# EAGLE design dongle (EAGLE 9.6.2)
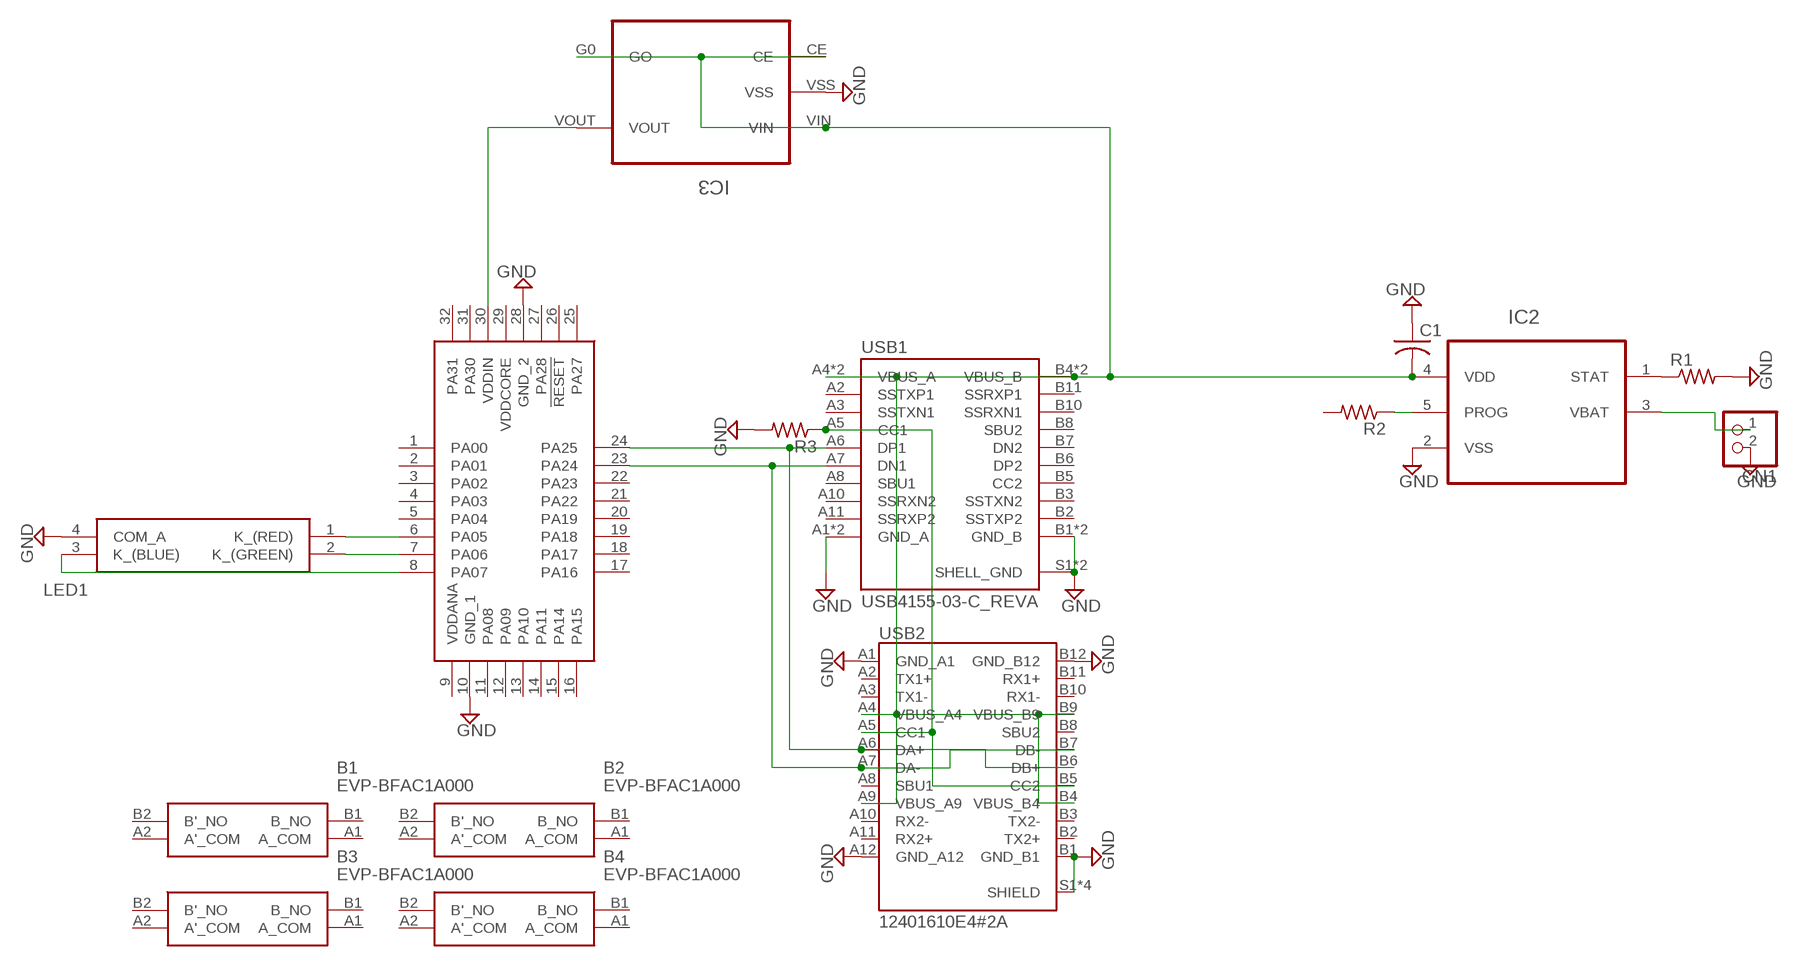
[diagram p0: schematic, sheet 1]

## Parts
B1  EVP-BFAC1A000  [EVPBFAC1A000]
B2  EVP-BFAC1A000  [EVPBFAC1A000]
B3  EVP-BFAC1A000  [EVPBFAC1A000]
B4  EVP-BFAC1A000  [EVPBFAC1A000]
C1  C-USC0805  [C0805]
CN1  JST_2PIN-SMT-RA  [JST-PH-2-SMT-RA]
IC1  ATSAMD21E18A-AFT  [QFP80P900X900X120-32N]
IC2  MCP73831T-2ACI/OT  [SOT95P280X145-5N]
IC3  IC_XC8107AC20MR-G  [IC_XC8107AC20MR-G]
LED1  ASMB-MTB1-0B3A2  [ASMBMTB10B3A2]
R1  R-US_R0805  [R0805]
R2  R-US_R0805  [R0805]
R3  R-US_R0805  [R0805]
USB1  USB4155-03-C_REVA  [GCT_USB4155-03-C_REVA]
USB2  12401610E4#2A  [AMPHENOL_12401610E4#2A]

## Nets
3.3V: IC1.30(VDDIN) IC3.VOUT
3.3VBAT: CN1.1 IC2.3(VBAT)
5VIN: C1.2 IC2.4(VDD) IC3.CE IC3.G0(GO) IC3.VIN USB1.A4(VBUS_A) USB1.A9(VBUS_A) USB1.B4(VBUS_B) USB1.B9(VBUS_B) USB2.A4(VBUS_A4) USB2.A9(VBUS_A9) USB2.B4(VBUS_B4) USB2.B9(VBUS_B9)
B: IC1.8(PA07) LED1.3(K_(BLUE))
CC: R3.1 USB1.A5(CC1) USB2.A5(CC1) USB2.B5(CC2)
D+: IC1.24(PA25) USB1.A6(DP1) USB2.A6(DA+) USB2.B6(DB+)
D-: IC1.23(PA24) USB1.A7(DN1) USB2.A7(DA-) USB2.B7(DB-)
G: IC1.7(PA06) LED1.2(K_(GREEN))
GND: C1.1 CN1.2 IC1.10(GND_1) IC1.28(GND_2) IC2.2(VSS) IC3.VSS LED1.4(COM_A) R1.2 R3.2 USB1.A1(GND_A) USB1.A12(GND_A) USB1.B1(GND_B) USB1.B12(GND_B) USB1.S1(SHELL_GND) USB1.S2(SHELL_GND) USB2.A1(GND_A1) USB2.A12(GND_A12) USB2.B1(GND_B1) USB2.B12(GND_B12) USB2.S1(SHIELD) USB2.S2(SHIELD) USB2.S3(SHIELD) USB2.S4(SHIELD)
PROG: IC2.5(PROG) R2.1
R: IC1.6(PA05) LED1.1(K_(RED))
STAT: IC2.1(STAT) R1.1
Unconnected: B1.A1(A_COM) B1.A2(A'_COM) B1.B1(B_NO) B1.B2(B'_NO) B2.A1(A_COM) B2.A2(A'_COM) B2.B1(B_NO) B2.B2(B'_NO) B3.A1(A_COM) B3.A2(A'_COM) B3.B1(B_NO) B3.B2(B'_NO) B4.A1(A_COM) B4.A2(A'_COM) B4.B1(B_NO) B4.B2(B'_NO) IC1.1(PA00) IC1.2(PA01) IC1.3(PA02) IC1.4(PA03) IC1.5(PA04) IC1.9(VDDANA) IC1.11(PA08) IC1.12(PA09) IC1.13(PA10) IC1.14(PA11) IC1.15(PA14) IC1.16(PA15) IC1.17(PA16) IC1.18(PA17) IC1.19(PA18) IC1.20(PA19) IC1.21(PA22) IC1.22(PA23) IC1.25(PA27) IC1.26(!RESET) IC1.27(PA28) IC1.29(VDDCORE) IC1.31(PA30) IC1.32(PA31) R2.2 USB1.A2(SSTXP1) USB1.A3(SSTXN1) USB1.A8(SBU1) USB1.A10(SSRXN2) USB1.A11(SSRXP2) USB1.B2(SSTXP2) USB1.B3(SSTXN2) USB1.B5(CC2) USB1.B6(DP2) USB1.B7(DN2) USB1.B8(SBU2) USB1.B10(SSRXN1) USB1.B11(SSRXP1) USB2.A2(TX1+) USB2.A3(TX1-) USB2.A8(SBU1) USB2.A10(RX2-) USB2.A11(RX2+) USB2.B2(TX2+) USB2.B3(TX2-) USB2.B8(SBU2) USB2.B10(RX1-) USB2.B11(RX1+)

## Library data of the parts
B1-B4 = EVP-BFAC1A000:EVP-BFAC1A000: Tactile Switches 6.0x6.0x3.4mm 2N w/4 Term .25mm Trvl IP67 Source: Datasheet <https://industrial.panasonic.com/cdbs/www-data/pdf/ATK0000/ATK0000C432.pdf>; DESCRIPTION: Tactile Switches 6.0x6.0x3.4mm 2N w/4 Term .25mm Trvl IP67; HEIGHT: 3.7mm; MANUFACTURER_NAME: Panasonic; MANUFACTURER_PART_NUMBER: EVP-BFAC1A000; MOUSER_PART_NUMBER: 667-EVP-BFAC1A000; MOUSER_PRICE-STOCK: https://www.mouser.co.uk/ProductDetail/Panasonic/EVP-BFAC1A000?qs=OiaALIbqWFSeImjptaxnOQ%3D%3D
C1 = adafruit:C-US: CAPACITOR, American symbol
CN1 = adafruit:JST_2PIN: JST 2-Pin Connectors of various flavors SMT-RA (S2B-PH-SM4) 4UConnector #17311 SMT (B2B-PH-SM4) THM-RA (S2B-PH) THM (B2B-PH)
IC1 = ATSAMD21E18A-AFT:ATSAMD21E18A-AFT: ARM Microcontrollers - MCU Cortex-M0+,64KB FLASH,8KB SRAM T&R, - 32TQFP 125C, GREEN,1.6-3.6V,48MHz Source: Datasheet <http://www.microchip.com/mymicrochip/filehandler.aspx?ddocname=en590209>; DESCRIPTION: ARM Microcontrollers - MCU Cortex-M0+,64KB FLASH,8KB SRAM T&R, - 32TQFP 125C, GREEN,1.6-3.6V,48MHz; HEIGHT: 1.2mm; MANUFACTURER_NAME: Microchip; MANUFACTURER_PART_NUMBER: ATSAMD21E18A-AFT; MOUSER_PART_NUMBER: 556-ATSAMD21E18A-AFT; MOUSER_PRICE-STOCK: https://www.mouser.co.uk/ProductDetail/Microchip-Technology-Atmel/ATSAMD21E18A-AFT?qs=9KdFJXLqUo%2Fx43XnpJTAog%3D%3D
IC2 = MCP73831T-2ACI_OT:MCP73831T-2ACI/OT: Charge Management Controller Check prices <https://pricing.snapeda.com/parts/MCP73831T-2ACI/OT/Microchip/view-part?ref=eda>; AVAILABILITY: In Stock; DESCRIPTION: Charger IC Lithium Ion/Polymer SOT-23-5; MF: Microchip; MP: MCP73831T-2ACI/OT; PACKAGE: SOT-23 Microchip; PRICE: None; PURCHASE-URL: https://pricing.snapeda.com/search/part/MCP73831T-2ACI/OT/?ref=eda
IC3 = IC_XC8107AC20MR-G:IC_XC8107AC20MR-G
LED1 = SamacSys_Parts:ASMB-MTB1-0B3A2: Standard LEDs - SMD PLCC4,T/Mt,BS/WF Silicone RGB Source: Datasheet <https://docs.broadcom.com/doc/AV02-4194EN>; DESCRIPTION: Standard LEDs - SMD PLCC4,T/Mt,BS/WF Silicone RGB; HEIGHT: 2.1mm; MANUFACTURER_NAME: Avago Technologies; MANUFACTURER_PART_NUMBER: ASMB-MTB1-0B3A2; MOUSER_PART_NUMBER: 630-ASMB-MTB1-0B3A2; MOUSER_PRICE-STOCK: https://www.mouser.co.uk/ProductDetail/Broadcom-Avago/ASMB-MTB1-0B3A2?qs=pUKx8fyJudDzsc2Rt%2Fv8dg%3D%3D
R1-R3 = rcl:R-US_: RESISTOR, American symbol; SPICEPREFIX: R
USB1 = USB4155-03-C_REVA:USB4155-03-C_REVA: Check prices <https://pricing.snapeda.com/parts/USB4155-03-C/Global%20Connector%20Technology/view-part?ref=eda>; AVAILABILITY: In Stock; DESCRIPTION: USB-C (USB TYPE-C) USB 3.2 Gen 2 (USB 3.1 Gen 2, Superspeed + (USB 3.1)) Plug Connector 24 Position Board Edge, Cutout; Surface Mount; Through Hole, Right Angle; MF: Global Connector Technology; MP: USB4155-03-C; PACKAGE: None; PRICE: None; PURCHASE-URL: https://pricing.snapeda.com/search/part/USB4155-03-C/?ref=eda
USB2 = 12401610E4_2A:12401610E4#2A: Usb Type-c, Ra Rcpt, Pcb Mount, Check prices <https://pricing.snapeda.com/parts/12401610E4%232A/Amphenol%20ICC%20%28Commercial%20Products%29/view-part?ref=eda>; AVAILABILITY: In Stock; DESCRIPTION: USB3.2 GEN2, Type C, Top mount, CH 1.58mm, Dual Row SMT; MF: Amphenol ICC (Commercial Products); MP: 12401610E4#2A; PACKAGE: None; PRICE: None; PURCHASE-URL: https://pricing.snapeda.com/search/part/12401610E4#2A/?ref=eda

## Board
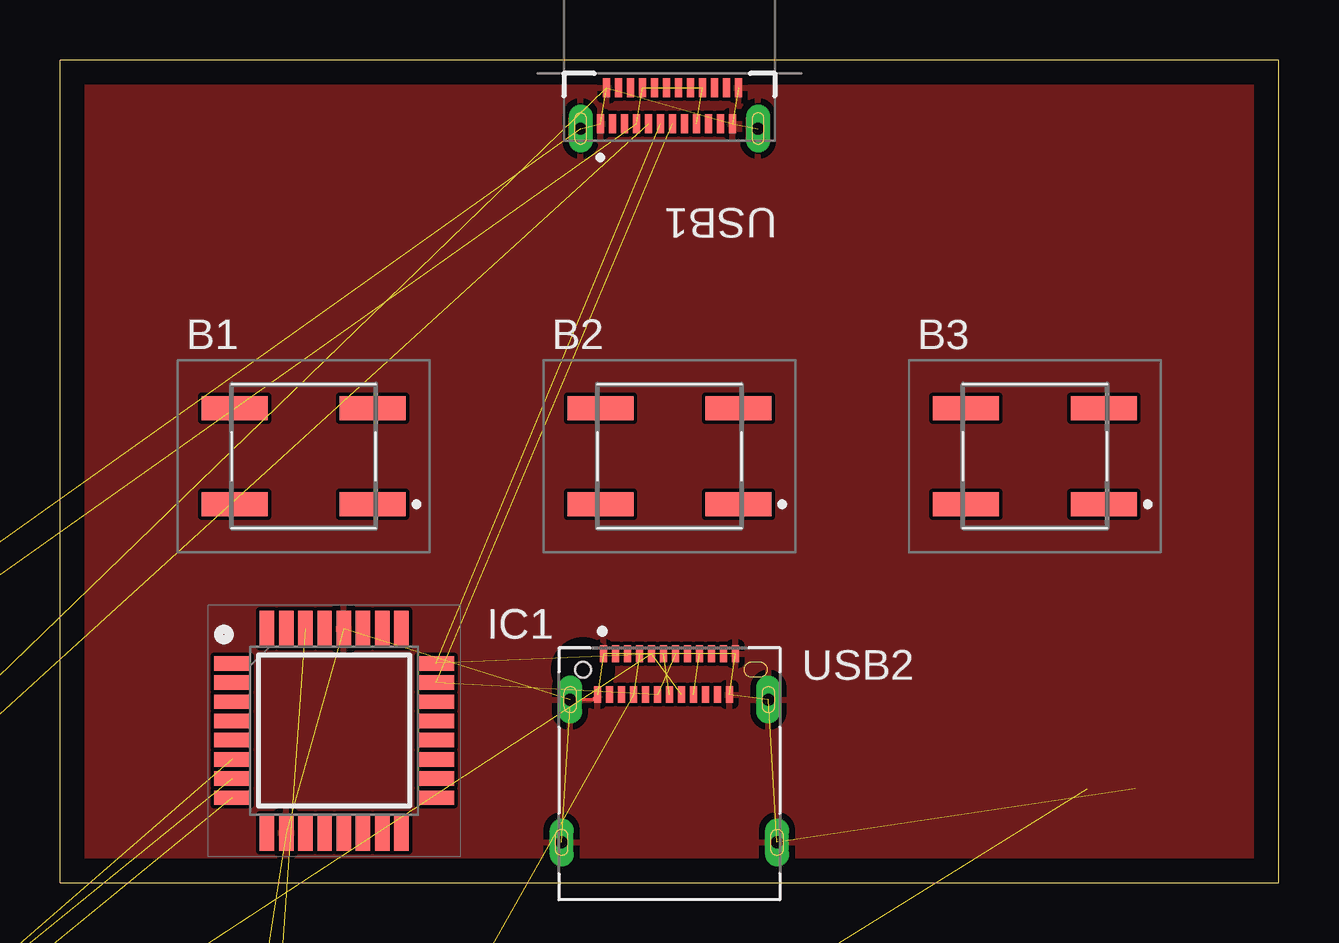
[diagram p1: board, top side]
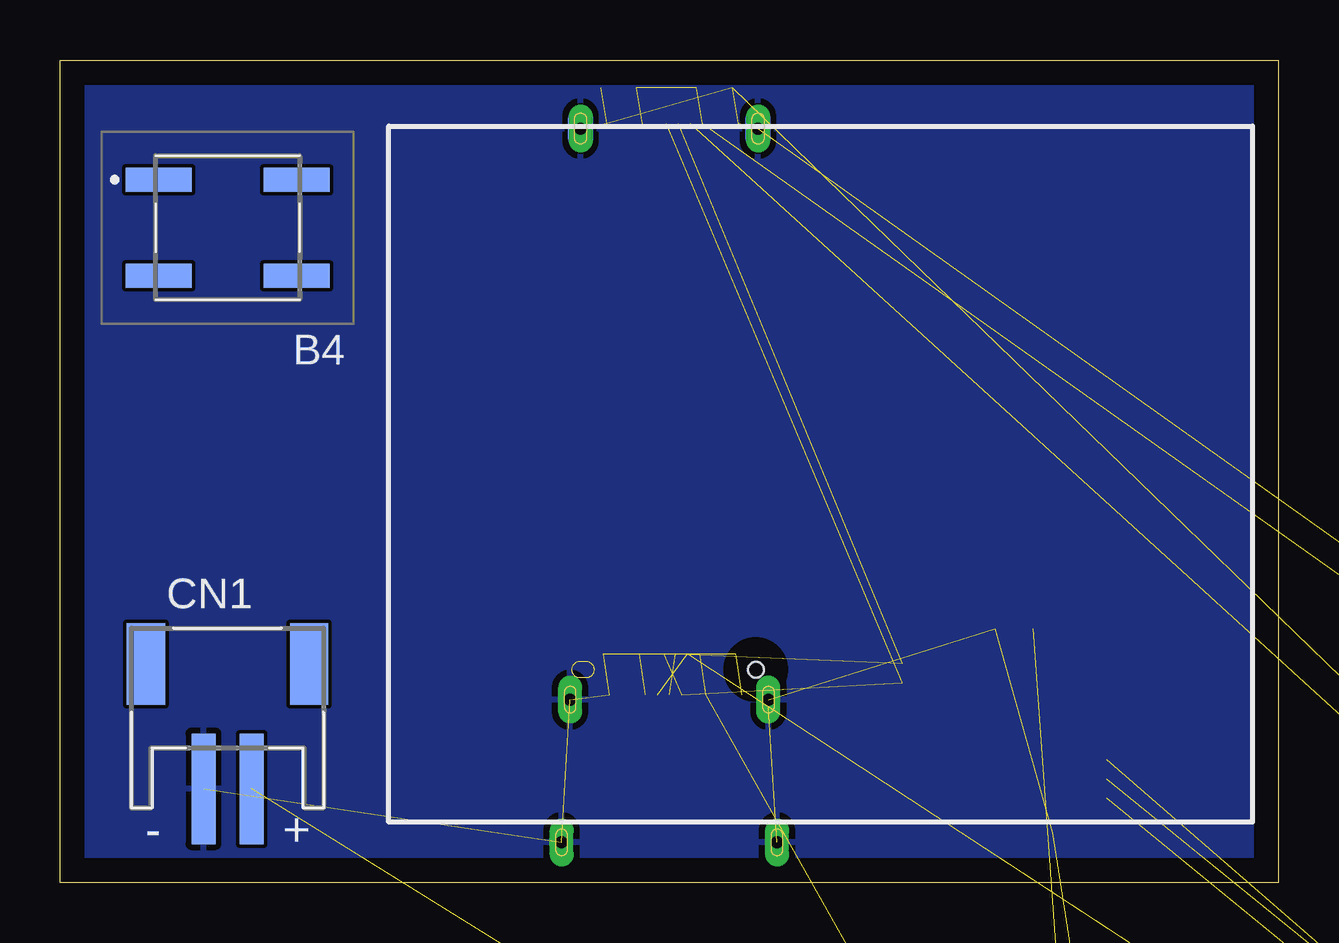
[diagram p2: board, bottom side, seen from below]

Size 50.8 x 34.29 mm. Coordinates in mm from the lower left corner, seen from the top.
Outline: 0,0 0,34.29 50.8,34.29 50.8,0 0,0
Copper layers (1*16): Top 0.035mm / dielectric 1.5mm / Bottom 0.035mm
Design rules "default": minimum track width 6mil, minimum drill 0.35mm, track to track 6mil, track to pad 6mil, pad to pad 6mil, via to via 6mil, smd to smd 6mil, copper to edge 40mil, drill to drill 6mil, minimum pad ring 10mil, minimum via ring 8mil, stop-mask expansion 4mil, vias tented up to drill 0mil, thermal gap 10mil

### Footprints (pad centres in the part's own frame; a part is rotated, then mirrored left to right if it is on the bottom)
EVPBFAC1A000 = smd 2.75 x 1: A1 2.875,-2; A2 -2.875,-2; B1 2.875,2; B2 -2.875,2
C0805 = smd 1.3 x 1.5: 1 -0.85,0; 2 0.85,0
JST-PH-2-SMT-RA = smd 1 x 4.6: 1 1,-3.7; 2 -1,-3.7 | smd 1.6 x 3.4: NC1 -3.4,1.5; NC2 3.4,1.5
QFP80P900X900X120-32N = smd 1.5 x 0.6: 1 -4.25,2.8; 2 -4.25,2; 3 -4.25,1.2; 4 -4.25,0.4; 5 -4.25,-0.4; 6 -4.25,-1.2; 7 -4.25,-2; 8 -4.25,-2.8; 17 4.25,-2.8; 18 4.25,-2; 19 4.25,-1.2; 20 4.25,-0.4; 21 4.25,0.4; 22 4.25,1.2; 23 4.25,2; 24 4.25,2.8 | smd 0.6 x 1.5: 9 -2.8,-4.25; 10 -2,-4.25; 11 -1.2,-4.25; 12 -0.4,-4.25; 13 0.4,-4.25; 14 1.2,-4.25; 15 2,-4.25; 16 2.8,-4.25; 25 2.8,4.25; 26 2,4.25; 27 1.2,4.25; 28 0.4,4.25; 29 -0.4,4.25; 30 -1.2,4.25; 31 -2,4.25; 32 -2.8,4.25
SOT95P280X145-5N = smd 1.27 x 0.559: 1 -1.295,0.94; 2 -1.295,0; 3 -1.295,-0.94; 4 1.295,-0.94; 5 1.295,0.94
IC_XC8107AC20MR-G = smd 1 x 0.7: CE -1.2,-0.95; G0 1.2,-0.95; VIN -1.2,0.95; VOUT 1.2,0.95; VSS -1.2,0
ASMBMTB10B3A2 = smd 1.1 x 1.5: 1 -0.75,-1.5; 2 -0.75,1.5; 3 0.75,1.5; 4 0.75,-1.5
R0805 = smd 1.3 x 1.5: 1 -0.95,0; 2 0.95,0
GCT_USB4155-03-C_REVA = smd 0.3 x 0.8: A1 2.875,0.75; A2 2.375,0.75; A3 1.875,0.75; A4 1.375,0.75; A5 0.875,0.75; A6 0.375,0.75; A7 -0.125,0.75; A8 -0.625,0.75; A9 -1.125,0.75; A10 -1.625,0.75; A11 -2.125,0.75; A12 -2.625,0.75; B1 -2.875,-0.75; B2 -2.375,-0.75; B3 -1.875,-0.75; B4 -1.375,-0.75; B5 -0.875,-0.75; B6 -0.375,-0.75; B7 0.125,-0.75; B8 0.625,-0.75; B9 1.125,-0.75; B10 1.625,-0.75; B11 2.125,-0.75; B12 2.625,-0.75 | drill 0.5 pad 0.8 long: S1 -3.7,0.95; S2 3.7,0.95
AMPHENOL_12401610E4#2A = smd 0.3 x 0.7: A1 -2.75,0.66; A2 -2.25,0.66; A3 -1.75,0.66; A4 -1.25,0.66; A5 -0.75,0.66; A6 -0.25,0.66; A7 0.25,0.66; A8 0.75,0.66; A9 1.25,0.66; A10 1.75,0.66; A11 2.25,0.66; A12 2.75,0.66; B1 2.5,-1.04; B2 2,-1.04; B3 1.5,-1.04; B4 1,-1.04; B5 0.5,-1.04; B6 0,-1.04; B7 -0.5,-1.04; B8 -1,-1.04; B9 -1.5,-1.04; B10 -2,-1.04; B11 -2.5,-1.04; B12 -3,-1.04 | drill 0.5 pad 0.8 long: S1 -4.13,-1.25; S2 4.13,-1.25; S3 4.49,-7.2; S4 -4.49,-7.2 | hole 0.65: -3.6,0

### Placement (x,y rotation side)
B1  10.16,17.78 0 top
B2  25.4,17.78 0 top
B3  40.64,17.78 0 top
B4  43.81,27.3 180 bottom
C1  -60.96,-27.94 0 top  (outside the outline)
CN1  43.81,7.62 0 bottom
IC1  11.43,6.35 0 top
IC2  7.62,-17.78 0 top  (outside the outline)
IC3  6.35,-27.94 0 top  (outside the outline)
LED1  -59.69,-52.07 0 top  (outside the outline)
R1  -60.96,-17.78 0 top  (outside the outline)
R2  -60.96,-22.86 0 top  (outside the outline)
R3  -60.96,-46.99 0 top  (outside the outline)
USB1  25.4,32.38 180 top
USB2  25.4,8.89 0 top

### Tracks (layer width: path | path; a pad name or v marks a point on that pad's centre or on a via)
3.3V  (1 unrouted)
3.3VBAT  (1 unrouted)
5VIN  (12 unrouted)
B  (1 unrouted)
CC  (3 unrouted)
D+  (3 unrouted)
D-  (3 unrouted)
G  (1 unrouted)
GND  (21 unrouted)
  Top 0.152: USB2.S1 22.19,7.64 USB2.B12
  Top 0.61: USB2.S1 21.27,7.3
  pour Top: 0,0 0,34.29 50.8,34.29 50.8,0
  pour Bottom: 0,0 0,34.29 50.8,34.29 50.8,0
PROG  (1 unrouted)
R  (1 unrouted)
STAT  (1 unrouted)